# Altium schematic sheet Control Loop.SchDoc
size 406 x 304 mm; SheetNumber: 3; SheetTotal: 14
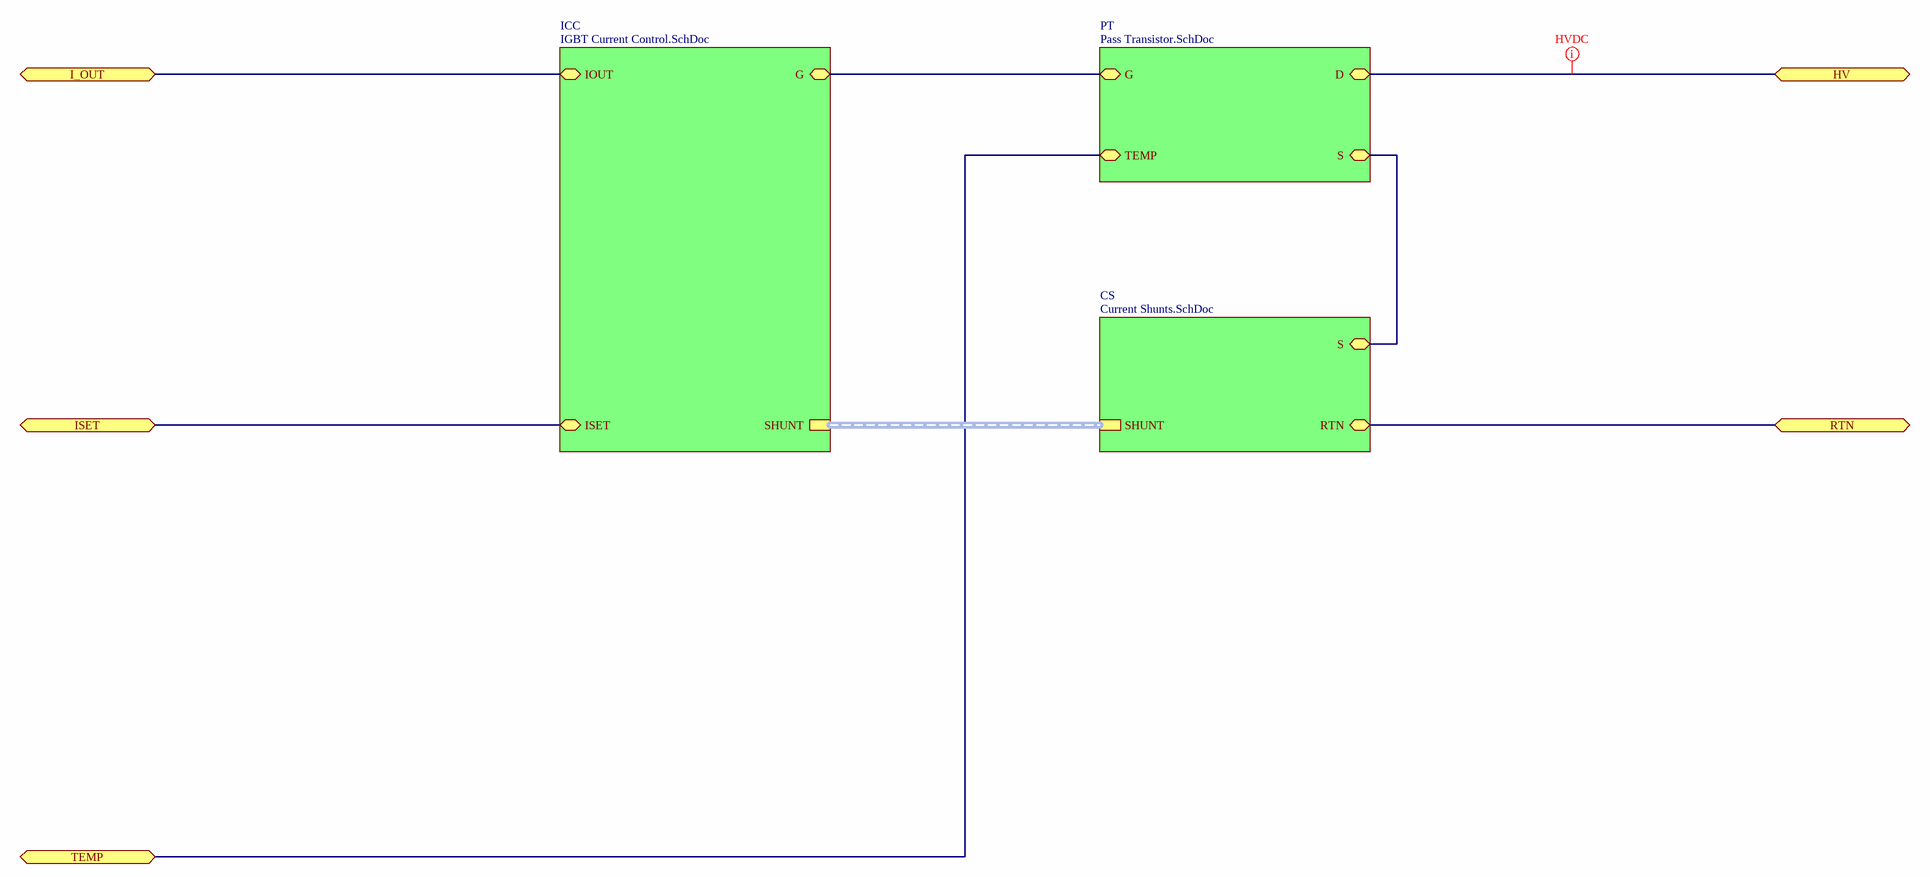
[diagram p0: Control Loop.SchDoc]

## Sub-sheets
CS = Current Shunts.SchDoc: S (bidir), SHUNT (harness SHUNT), RTN (bidir)
ICC = IGBT Current Control.SchDoc: SHUNT (harness SHUNT), ISET (bidir), IOUT (bidir), G (bidir)
PT = Pass Transistor.SchDoc: D (bidir), S (bidir), G (bidir), TEMP (bidir)

## Ports
HV (bidir), I_OUT (bidir), ISET (bidir), RTN (bidir), TEMP (bidir)

## Nets
HV: port HV, sheet PT/D
I_OUT: port I_OUT, sheet ICC/IOUT
ISET: port ISET, sheet ICC/ISET
RTN: port RTN, sheet CS/RTN
TEMP: port TEMP, sheet PT/TEMP
(unnamed): sheet ICC/G, sheet PT/G
(unnamed): sheet CS/S, sheet PT/S

## Buses and harness runs
harness sheet CS/SHUNT = sheet ICC/SHUNT

## Layout directives
net class HVDC: HV

## Notes on the sheet
- Rev
- Sheet Name:
- Date:
- Sheet
- Designer:
- of